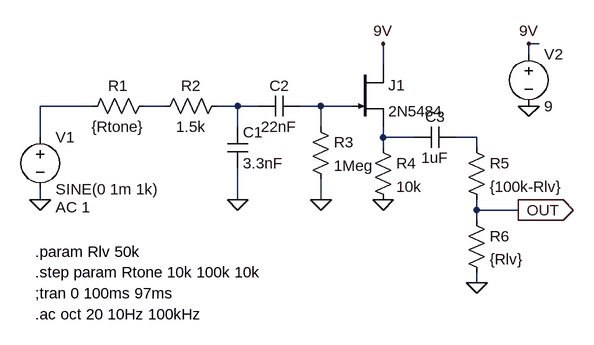
[diagram p0: schematic ProcoRAT_Tone.asc]
ProcoRAT_Tone.asc, the LTspice schematic file:
Version 4
SHEET 1 880 680
WIRE 752 32 736 32
WIRE 736 48 736 32
WIRE 512 64 512 32
WIRE 64 128 -16 128
WIRE 176 128 144 128
WIRE 288 128 256 128
WIRE 320 128 288 128
WIRE 416 128 384 128
WIRE 464 128 416 128
WIRE 288 160 288 128
WIRE 416 160 416 128
WIRE -16 176 -16 128
WIRE 512 176 512 160
WIRE 560 176 512 176
WIRE 656 176 624 176
WIRE 512 192 512 176
WIRE 656 192 656 176
WIRE -16 272 -16 256
WIRE 288 272 288 224
WIRE 416 272 416 240
WIRE 656 288 656 272
WIRE 720 288 656 288
WIRE 656 304 656 288
WIRE 656 400 656 384
FLAG 656 400 0
FLAG 512 272 0
FLAG 416 272 0
FLAG 288 272 0
FLAG -16 272 0
FLAG 512 32 9V
FLAG 720 288 OUT
IOPIN 720 288 Out
FLAG 736 128 0
FLAG 736 32 9V
SYMBOL res 160 112 R90
WINDOW 0 0 56 VBottom 2
WINDOW 3 32 56 VTop 2
SYMATTR InstName R1
SYMATTR Value {Rtone}
SYMBOL res 272 112 R90
WINDOW 0 0 56 VBottom 2
WINDOW 3 32 56 VTop 2
SYMATTR InstName R2
SYMATTR Value 1.5k
SYMBOL cap 272 160 R0
SYMATTR InstName C1
SYMATTR Value 3.3nF
SYMBOL cap 384 112 R90
WINDOW 0 0 32 VBottom 2
WINDOW 3 32 32 VTop 2
SYMATTR InstName C2
SYMATTR Value 22nF
SYMBOL res 400 144 R0
SYMATTR InstName R3
SYMATTR Value 1Meg
SYMBOL njf 464 64 R0
SYMATTR InstName J1
SYMATTR Value 2N5484
SYMBOL res 496 176 R0
SYMATTR InstName R4
SYMATTR Value 10k
SYMBOL cap 624 160 R90
WINDOW 0 0 32 VBottom 2
WINDOW 3 32 32 VTop 2
SYMATTR InstName C3
SYMATTR Value 1uF
SYMBOL res 640 176 R0
SYMATTR InstName R5
SYMATTR Value {100k-Rlv}
SYMBOL res 640 288 R0
SYMATTR InstName R6
SYMATTR Value {Rlv}
SYMBOL voltage -16 160 R0
WINDOW 123 24 124 Left 2
WINDOW 39 0 0 Left 2
SYMATTR Value2 AC 1
SYMATTR InstName V1
SYMATTR Value SINE(0 1m 1k)
SYMBOL voltage 736 32 R0
WINDOW 123 0 0 Left 2
WINDOW 39 0 0 Left 2
SYMATTR InstName V2
SYMATTR Value 9
TEXT -24 352 Left 2 !.param Rlv 50k
TEXT -24 384 Left 2 !.step param Rtone 10k 100k 10k
TEXT -24 416 Left 2 !;tran 0 100ms 97ms
TEXT -24 448 Left 2 !.ac oct 20 10Hz 100kHz

The netlist it stands for:
* ProcoRAT_Tone.asc
R1 N002 N001 {Rtone}
R2 N003 N002 1.5k
C1 N003 0 3.3nF
C2 N004 N003 22nF
R3 N004 0 1Meg
J1 9V N004 N005 2N5484
R4 N005 0 10k
C3 N006 N005 1uF
R5 N006 OUT {100k-Rlv}
R6 OUT 0 {Rlv}
V1 N001 0 SINE(0 1m 1k) AC 1
V2 9V 0 9
.model NJF NJF
.model PJF PJF
.lib standard.jft
.param Rlv 50k
.step param Rtone 10k 100k 10k
;tran 0 100ms 97ms
.ac oct 20 10Hz 100kHz
.backanno
.end